# EAGLE design PISO2sch (EAGLE 9.6.2)
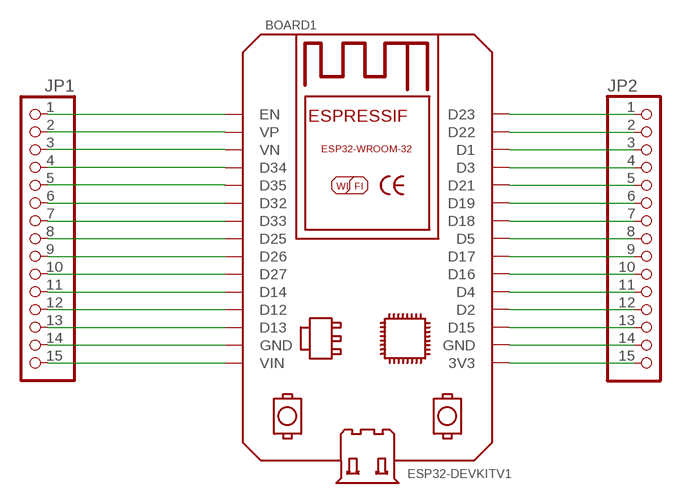
[diagram p0: schematic, sheet 1]

## Parts
BOARD1  ESP32DEVKITV1  [ESP32-DEVKITV1]
JP1  PINHD-1X15  [1X15]
JP2  PINHD-1X15  [1X15]

## Nets
N$1: BOARD1.D34 JP1.4
N$2: BOARD1.VN JP1.3
N$3: BOARD1.VP JP1.2
N$4: BOARD1.EN JP1.1
N$5: BOARD1.D35 JP1.5
N$6: BOARD1.D32 JP1.6
N$7: BOARD1.D33 JP1.7
N$8: BOARD1.D25 JP1.8
N$9: BOARD1.D26 JP1.9
N$10: BOARD1.D27 JP1.10
N$11: BOARD1.D14 JP1.11
N$12: BOARD1.D12 JP1.12
N$13: BOARD1.D13 JP1.13
N$14: BOARD1.GND JP1.14
N$15: BOARD1.VIN JP1.15
N$16: BOARD1.D23 JP2.1
N$17: BOARD1.D22 JP2.2
N$18: BOARD1.D1 JP2.3
N$19: BOARD1.D3 JP2.4
N$20: BOARD1.D21 JP2.5
N$21: BOARD1.D19 JP2.6
N$22: BOARD1.D18 JP2.7
N$23: BOARD1.D5 JP2.8
N$24: BOARD1.D17 JP2.9
N$25: BOARD1.D16 JP2.10
N$26: BOARD1.D4 JP2.11
N$27: BOARD1.D2 JP2.12
N$28: BOARD1.D15 JP2.13
N$29: BOARD1.GND@1(GND) JP2.14
N$30: BOARD1.3V3 JP2.15

## Library data of the parts
BOARD1 = ESP32-DEVKITV1:ESP32DEVKITV1: https://github.com/shridattdudhat
JP1 JP2 = pinhead:PINHD-1X15: PIN HEADER

## Board
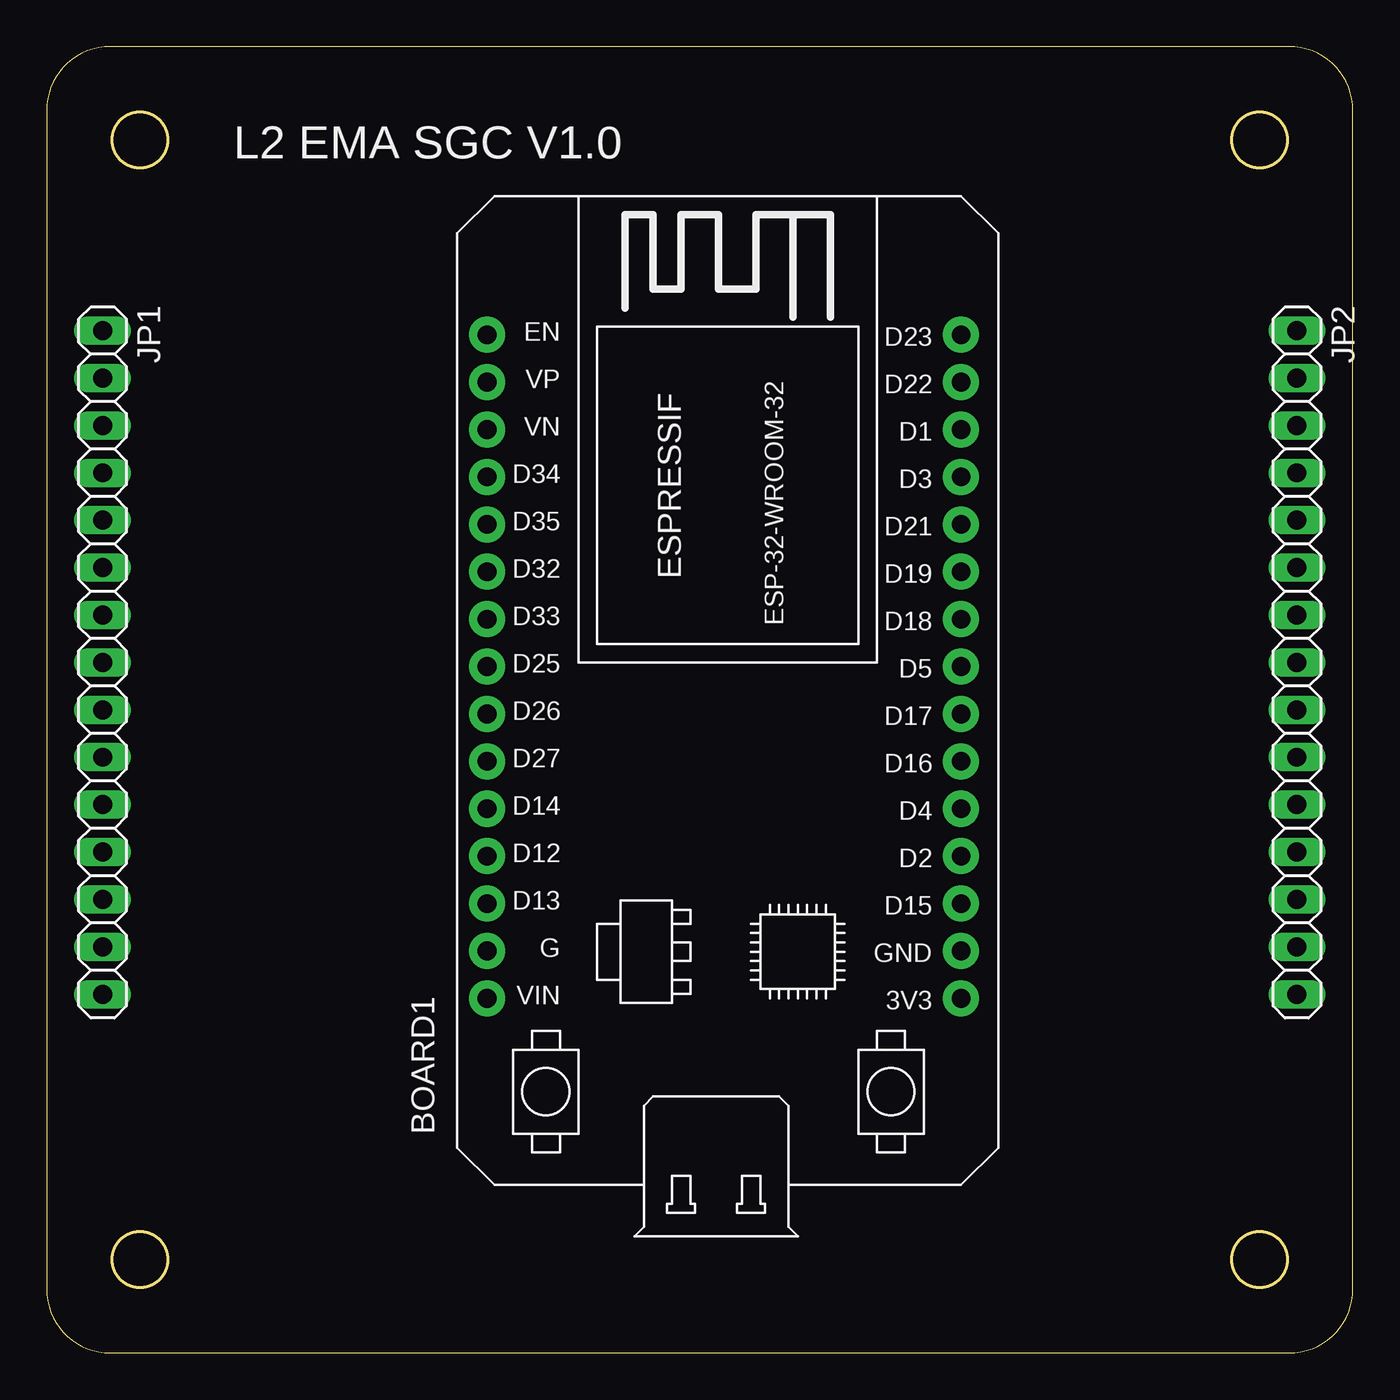
[diagram p1: board, top side]
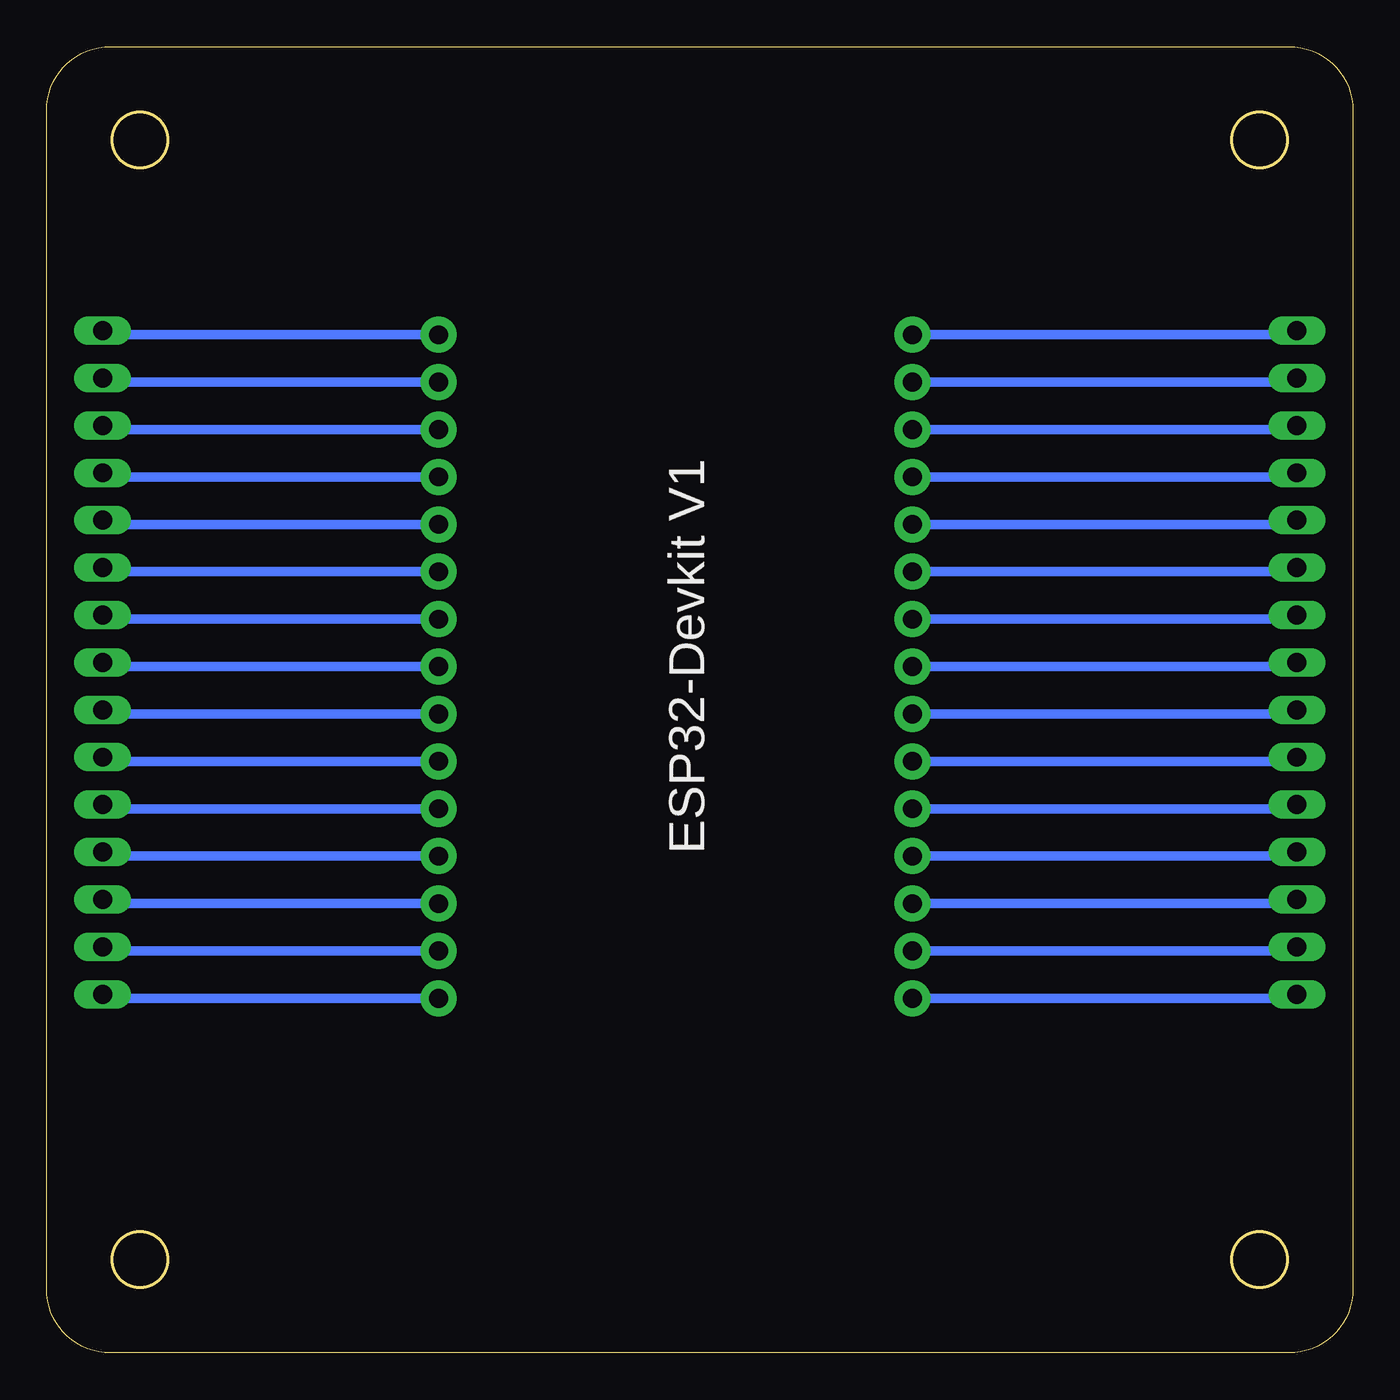
[diagram p2: board, bottom side, seen from below]

Size 70 x 70 mm. Coordinates in mm from the lower left corner, seen from the top.
Outline: 0,66.59 0,3.41 arc90 3.41,0 66.59,0 arc90 70,3.41 70,66.59 arc90 66.59,70 3.41,70 arc90 0,66.59
Outline: circle at 5,65 radius 1.5
Outline: circle at 65,65 radius 1.5
Outline: circle at 5,5 radius 1.5
Outline: circle at 65,5 radius 1.5
Copper layers (1*16): Top 0.035mm / dielectric 1.5mm / Bottom 0.035mm
Design rules "default": minimum track width 6mil, minimum drill 0.35mm, track to track 6mil, track to pad 6mil, pad to pad 6mil, via to via 6mil, smd to smd 6mil, copper to edge 40mil, drill to drill 6mil, minimum pad ring 10mil, minimum via ring 8mil, stop-mask expansion 4mil, vias tented up to drill 0mil, thermal gap 10mil

### Footprints (pad centres in the part's own frame; a part is rotated, then mirrored left to right if it is on the bottom)
ESP32-DEVKITV1 = drill 1 pad 1.93: 3V3 0,0; D1 30.48,0; D2 7.62,0; D3 27.94,0; D4 10.16,0; D5 17.78,0; D12 7.62,25.4; D13 5.08,25.4; D14 10.16,25.4; D15 5.08,0; D16 12.7,0; D17 15.24,0; D18 20.32,0; D19 22.86,0; D21 25.4,0; D22 33.02,0; D23 35.56,0; D25 17.78,25.4; D26 15.24,25.4; D27 12.7,25.4; D32 22.86,25.4; D33 20.32,25.4; D34 27.94,25.4; D35 25.4,25.4; EN 35.56,25.4; GND 2.54,25.4; GND@1 2.54,0; VIN 0,25.4; VN 30.48,25.4; VP 33.02,25.4
1X15 = drill 1.016 long: 1 -17.78,0; 2 -15.24,0; 3 -12.7,0; 4 -10.16,0; 5 -7.62,0; 6 -5.08,0; 7 -2.54,0; 8 0,0; 9 2.54,0; 10 5.08,0; 11 7.62,0; 12 10.16,0; 13 12.7,0; 14 15.24,0; 15 17.78,0

### Placement (x,y rotation side)
BOARD1  49,19 90 top
JP1  3,37 270 top
JP2  67,37 270 top

### Tracks (layer width: path | path; a pad name or v marks a point on that pad's centre or on a via)
N$1
  Bottom 0.508: BOARD1.D34 3.22,46.94 JP1.4
N$2
  Bottom 0.508: BOARD1.VN 3.22,49.48 JP1.3
N$3
  Bottom 0.508: BOARD1.VP 3.22,52.02 JP1.2
N$4
  Bottom 0.508: BOARD1.EN 3.22,54.56 JP1.1
N$5
  Bottom 0.508: BOARD1.D35 3.22,44.4 JP1.5
N$6
  Bottom 0.508: BOARD1.D32 3.22,41.86 JP1.6
N$7
  Bottom 0.508: BOARD1.D33 3.22,39.32 JP1.7
N$8
  Bottom 0.508: JP1.8 3.22,36.78 BOARD1.D25
N$9
  Bottom 0.508: BOARD1.D26 3.22,34.24 JP1.9
N$10
  Bottom 0.508: JP1.10 3.22,31.7 BOARD1.D27
N$11
  Bottom 0.508: BOARD1.D14 3.22,29.16 JP1.11
N$12
  Bottom 0.508: BOARD1.D12 3.22,26.62 JP1.12
N$13
  Bottom 0.508: BOARD1.D13 3.22,24.08 JP1.13
N$14
  Bottom 0.508: BOARD1.GND 3.22,21.54 JP1.14
N$15
  Bottom 0.508: BOARD1.VIN 3.22,19 JP1.15
N$16
  Bottom 0.508: JP2.1 66.78,54.56 BOARD1.D23
N$17
  Bottom 0.508: JP2.2 66.78,52.02 BOARD1.D22
N$18
  Bottom 0.508: JP2.3 66.78,49.48 BOARD1.D1
N$19
  Bottom 0.508: JP2.4 66.78,46.94 BOARD1.D3
N$20
  Bottom 0.508: JP2.5 66.78,44.4 BOARD1.D21
N$21
  Bottom 0.508: JP2.6 66.78,41.86 BOARD1.D19
N$22
  Bottom 0.508: JP2.7 66.78,39.32 BOARD1.D18
N$23
  Bottom 0.508: JP2.8 66.78,36.78 BOARD1.D5
N$24
  Bottom 0.508: JP2.9 66.78,34.24 BOARD1.D17
N$25
  Bottom 0.508: JP2.10 66.78,31.7 BOARD1.D16
N$26
  Bottom 0.508: JP2.11 66.78,29.16 BOARD1.D4
N$27
  Bottom 0.508: JP2.12 66.78,26.62 BOARD1.D2
N$28
  Bottom 0.508: JP2.13 66.78,24.08 BOARD1.D15
N$29
  Bottom 0.508: JP2.14 66.78,21.54 BOARD1.GND@1
N$30
  Bottom 0.508: JP2.15 66.78,19 BOARD1.3V3

### Text on the board
tNames: L2 EMA SGC V1.0